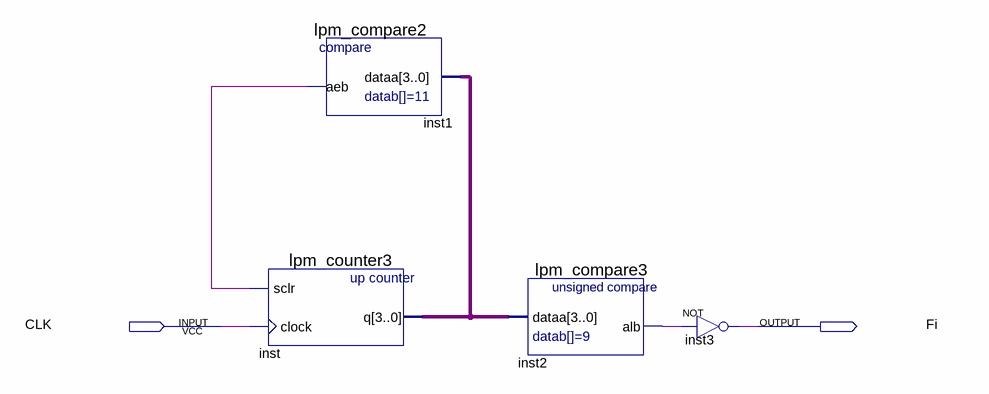
[diagram p0: schematic sheet]
// Quartus schematic Block1.bdf as structural Verilog: 4 symbols, 2 pins
module Block1 (
  input  CLK,
  output Fi
);

  wire inst1_aeb, inst2_alb;
  wire [3:0] inst_q;

  lpm_counter3 inst (.sclr(inst1_aeb), .clock(CLK), .q(inst_q));
  lpm_compare2 inst1 (.dataa(inst_q), .aeb(inst1_aeb));
  lpm_compare3 inst2 (.dataa(inst_q), .alb(inst2_alb));
  not inst3 (Fi, inst2_alb);
endmodule
